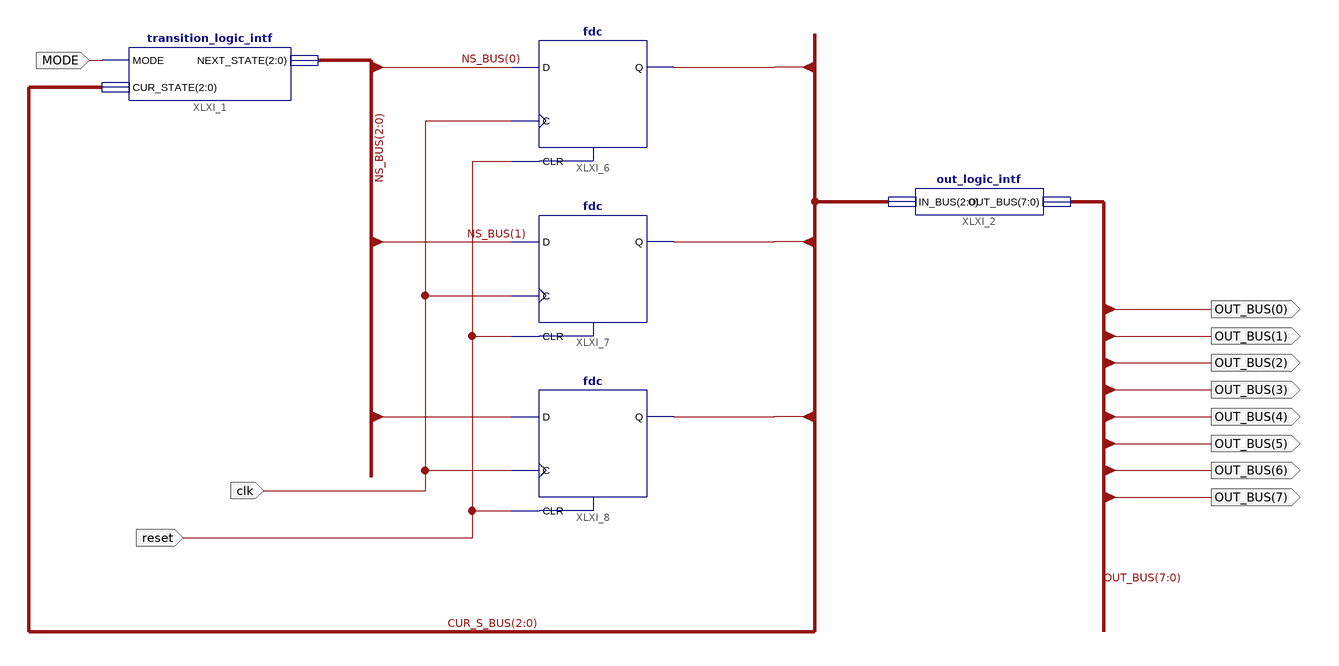
[diagram p0: schematic sheet 1]
// Xilinx ISE schematic LightController.sch (spartan3a) as structural Verilog: 5 symbols, 11 ports
module LightController (
  input  MODE,
  input  clk,
  input  reset,
  output [7:0] OUT_BUS
);

  wire [2:0] CUR_S_BUS, NS_BUS;

  transition_logic_intf XLXI_1 (.MODE(MODE), .CUR_STATE(CUR_S_BUS), .NEXT_STATE(NS_BUS));
  out_logic_intf XLXI_2 (.IN_BUS(CUR_S_BUS), .OUT_BUS(OUT_BUS));
  fdc XLXI_6 (.C(clk), .CLR(reset), .D(NS_BUS[0]), .Q(CUR_S_BUS[0]));
  fdc XLXI_7 (.C(clk), .CLR(reset), .D(NS_BUS[1]), .Q(CUR_S_BUS[1]));
  fdc XLXI_8 (.C(clk), .CLR(reset), .D(NS_BUS[2]), .Q(CUR_S_BUS[2]));
endmodule
